# EAGLE schematic MirrorController (EAGLE 7.4.0)
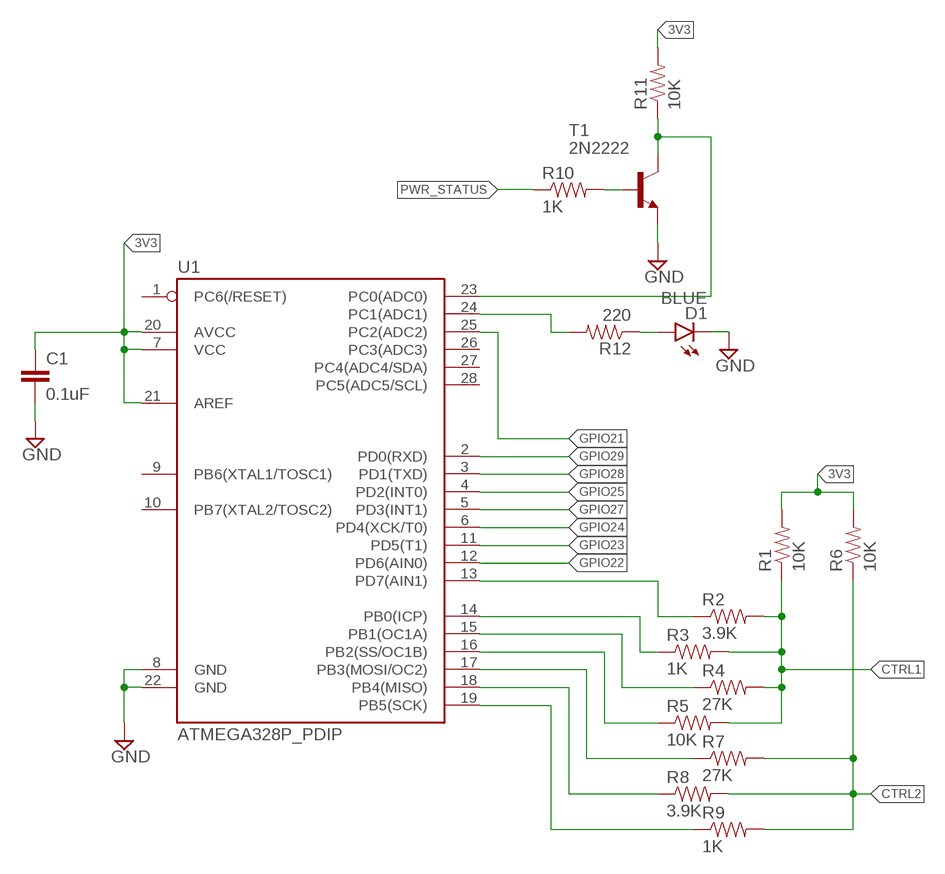
[diagram p0: schematic, sheet 1]

## Parts
C1  0.1uF  CAPPTH  [CAP-PTH-SMALL]
D1  BLUE  LED5MM  [LED5MM]
R1  10K  RESISTORPTH-1/4W  [AXIAL-0.4]
R2  3.9K  RESISTORPTH-1/4W  [AXIAL-0.4]
R3  1K  RESISTORPTH-1/4W  [AXIAL-0.4]
R4  27K  RESISTORPTH-1/4W  [AXIAL-0.4]
R5  10K  RESISTORPTH-1/4W  [AXIAL-0.4]
R6  10K  RESISTORPTH-1/4W  [AXIAL-0.4]
R7  27K  RESISTORPTH-1/4W  [AXIAL-0.4]
R8  3.9K  RESISTORPTH-1/4W  [AXIAL-0.4]
R9  1K  RESISTORPTH-1/4W  [AXIAL-0.4]
R10  1K  RESISTORPTH-1/4W  [AXIAL-0.4]
R11  10K  RESISTORPTH-1/4W  [AXIAL-0.4]
R12  220  RESISTORPTH-1/4W  [AXIAL-0.4]
T1  2N2222  [TO92-EBC-OVAL]
U1  ATMEGA328P_PDIP  [DIL28-3]

## Nets
3V3: C1.1 R1.P$2 R6.P$2 R11.P$2 U1.7(VCC) U1.20(AVCC) U1.21(AREF)
CTRL1: R1.P$1 R2.P$2 R3.P$2 R4.P$2 R5.P$2
CTRL2: R6.P$1 R7.P$2 R8.P$2 R9.P$2
GND: C1.2 D1.K(C) T1.E U1.8(GND) U1.22(GND)
GPIO21: U1.25(PC2(ADC2))
GPIO22: U1.12(PD6(AIN0))
GPIO23: U1.11(PD5(T1))
GPIO24: U1.6(PD4(XCK/T0))
GPIO25: U1.4(PD2(INT0))
GPIO27: U1.5(PD3(INT1))
GPIO28: U1.3(PD1(TXD))
GPIO29: U1.2(PD0(RXD))
N$1: R2.P$1 U1.13(PD7(AIN1))
N$2: R3.P$1 U1.14(PB0(ICP))
N$3: R4.P$1 U1.15(PB1(OC1A))
N$4: R5.P$1 U1.16(PB2(SS/OC1B))
N$5: R7.P$1 U1.17(PB3(MOSI/OC2))
N$6: R8.P$1 U1.18(PB4(MISO))
N$7: R9.P$1 U1.19(PB5(SCK))
N$8: R10.P$2 T1.B
N$9: R11.P$1 T1.C U1.23(PC0(ADC0))
N$10: D1.A R12.P$1
N$11: R12.P$2 U1.24(PC1(ADC1))
PWR_STATUS: R10.P$1
Unconnected: U1.1(PC6(/RESET)) U1.9(PB6(XTAL1/TOSC1)) U1.10(PB7(XTAL2/TOSC2)) U1.26(PC3(ADC3)) U1.27(PC4(ADC4/SDA)) U1.28(PC5(ADC5/SCL))

## Library data of the parts
C1 = SparkFun-Capacitors:CAP: Capacitor Standard 0603 ceramic capacitor, and 0.1" leaded capacitor.
D1 = SparkFun-LED:LED: LEDs Standard schematic elements and footprints for 5mm, 3mm, 1206, and 0603 sized LEDs. 5mm - Spark Fun Electronics SKU : COM-00529 (and others)
R1-R12 = SparkFun-Resistors:RESISTOR: Resistor Basic schematic elements and footprints for 0603, 1206, and PTH resistors.
T1 = adafruit:2N2222: NPN TRANSISTOR Big oval pads
U1 = SparkFun-DigitalIC:ATMEGA328P_PDIP: uC used in the Arduino 32kb flash, 1k EEPROM, 2k SRAM This is the through-hole version of this chip.